# EAGLE design pc3_ext_lis3dh (EAGLE 9.6.2)
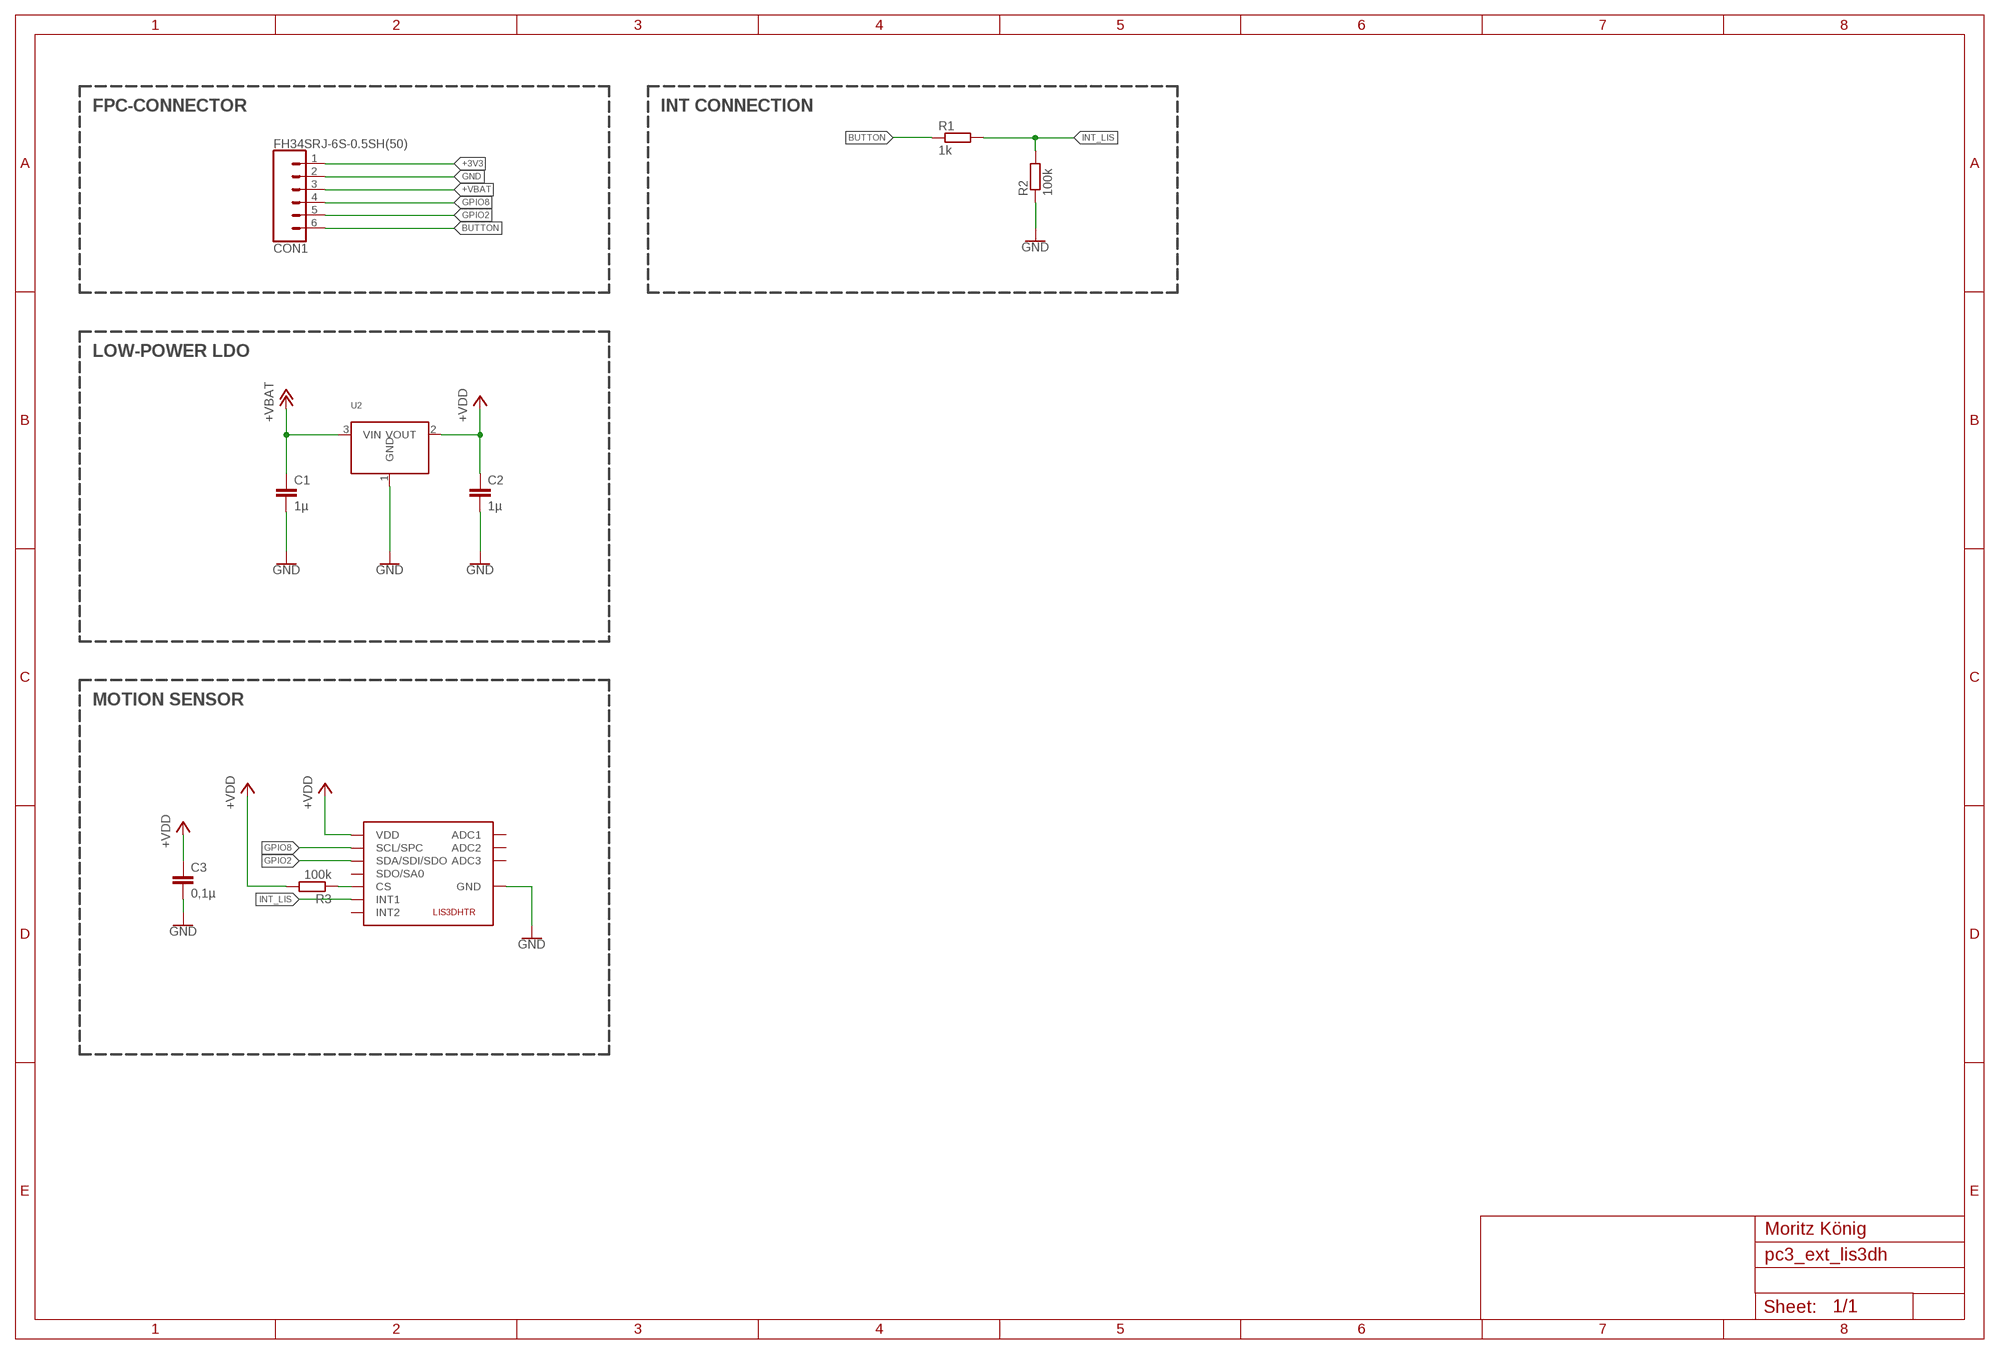
[diagram p0: schematic, sheet 1]

## Parts
C1  1µ  C0402_S  [C0402_S]
C2  1µ  C0402_S  [C0402_S]
C3  0,1µ  C0402_S  [C0402_S]
CON1  FH34SRJ-6S-0.5SH(50)  [FH34SRJ-6S-0.5SH(50)]
R1  1k  R0402  [R0402]
R2  100k  R0402  [R0402]
R3  100k  R0402  [R0402]
U1  LIS3DHTR  [LGA_16_LIS3DHTR]
U2  SE82XX  [SOT23-3]

## Nets
+3V3: CON1.1
+VBAT: C1.P$1 CON1.3 U2.3(VIN)
+VDD: C2.P$1 C3.P$1 R3.2 U1.P$1(VDD) U1.P$14(VDD) U2.2(VOUT)
BUTTON: CON1.6 R1.1
GND: C1.P$2 C2.P$2 C3.P$2 CON1.2 R2.1 U1.P$5(GND) U1.P$10(GND) U1.P$12(GND) U2.1(GND)
GPIO2: CON1.5 U1.P$6(SDA/SDI/SDO)
GPIO8: CON1.4 U1.P$4(SCL/SPC)
INT_LIS: R1.2 R2.2 U1.P$11(INT1)
N$1: R3.1 U1.P$8(CS)
Unconnected: U1.P$7(SDO/SA0) U1.P$9(INT2) U1.P$13(ADC3) U1.P$15(ADC2) U1.P$16(ADC1)

## Notes on the sheet
- FPC-CONNECTOR | INT CONNECTION
- LOW-POWER LDO
- MOTION SENSOR
- Moritz König

## Library data of the parts
C1-C3 = moekoe_rcl:C0402
CON1 = moekoe_hardware:FH34SRJ-6S-0.5SH(50)
R1-R3 = moekoe_rcl:R0402
U1 = moekoe_sensors:LIS3DHTR
U2 = moekoe_ics:SE82XX

## Board
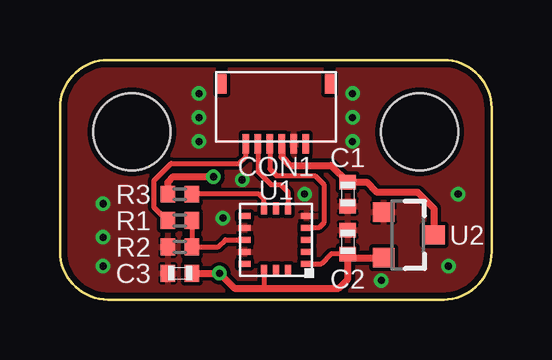
[diagram p1: board, top side]
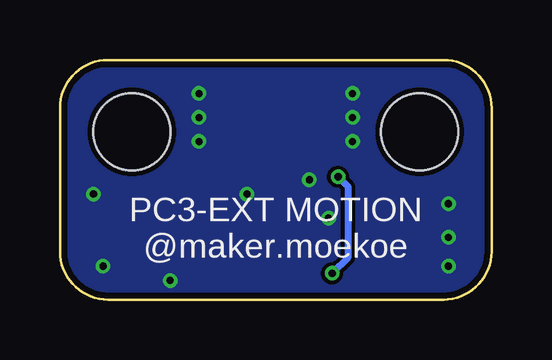
[diagram p2: board, bottom side, seen from below]

Size 18 x 10 mm. Coordinates in mm from the lower left corner, seen from the top.
Outline: 18,2 18,8 arc90 16,10 2,10 arc90 0,8 0,2 arc90 2,0 16,0 arc90 18,2
Copper layers (1*16): Top 0.035mm / dielectric 0.93mm / Bottom 0.035mm
Design rules "2020.08.24_4layers_eagle *": minimum track width 6mil, minimum drill 0.2mm, track to track 6mil, track to pad 6mil, pad to pad 6mil, via to via 6mil, smd to smd 6mil, copper to edge 10mil, drill to drill 6mil, minimum pad ring 10mil, minimum via ring 6mil, stop-mask expansion 0mil, vias tented up to drill 0.5mm, thermal gap 4mil
Holes 3.2 mm at 3,7 15,7

### Footprints (pad centres in the part's own frame; a part is rotated, then mirrored left to right if it is on the bottom)
C0402_S = smd 0.6 x 0.7: P$1 -0.5,0; P$2 0.5,0
FH34SRJ-6S-0.5SH(50) = smd 0.28 x 0.8: 1 -1.25,0; 2 -0.75,0; 3 -0.25,0; 4 0.25,0; 5 0.75,0; 6 1.25,0 | smd 0.4 x 0.8: P$1 -2.25,-2.5; P$2 2.25,-2.5
R0402 = smd 0.6 x 0.7: 1 -0.5,0; 2 0.5,0
LGA_16_LIS3DHTR = smd 0.5 x 0.25: P$1 -1.3,1; P$2 -1.3,0.5; P$3 -1.3,0; P$4 -1.3,-0.5; P$5 -1.3,-1; P$9 1.3,-1; P$10 1.3,-0.5; P$11 1.3,0; P$12 1.3,0.5; P$13 1.3,1 | smd 0.25 x 0.5: P$6 -0.5,-1.3; P$7 0,-1.3; P$8 0.5,-1.3; P$14 0.5,1.3; P$15 0,1.3; P$16 -0.5,1.3
SOT23-3 = smd 0.8 x 0.9: 1 -0.95,-1; 2 0.95,-1; 3 0,1.1

### Placement (x,y rotation side)
C1  12,4.4 270 top
C2  12,2.4 90 top
C3  5,1.1 180 top
CON1  9,6.5 180 top
R1  5,3.3 0 top
R2  5,2.2 0 top
R3  5,4.4 180 top
U1  9,2.5 180 top
U2  14.5,2.7 270 top

### Tracks (layer width: path | path; a pad name or v marks a point on that pad's centre or on a via)
+VBAT
  Top 0.3: CON1.3 9.25,5.95 9.6,5.6 11.3,5.6 C1.P$1 12.8,4.9 13.22,4.47 14.93,4.47 15.6,3.8 U2.3
+VDD  (via drill 0.3 pad 0.6)
  Top 0.2: U1.P$1 10.9,1.5 11.3,1.9 C2.P$1 | U1.P$14 8.5,0.47
  Top 0.3: U2.2 12.15,1.75 C2.P$1 12,0.85 11.62,0.47 8.5,0.47 7.28,0.47 v6.65,1.1 C3.P$1 | R3.2 4.5,4.9 4.73,5.13 v6.4,5.13
  Bottom 0.3: v6.4,5.13 6,4.73 6,1.75 v6.65,1.1
BUTTON
  Top 0.2: R1.1 4.47,3.3 3.92,3.85 3.92,4.96 4.64,5.68 7.46,5.68 7.75,5.97 CON1.6
GND  (via drill 0.3 pad 0.6)
  other vias: 1.8,2.6 5.8,8.6 5.8,7.6 5.8,6.6 12.2,8.6 12.2,7.6 12.2,6.6 10.2,4.4 16.2,1.4 16.6,4.4 6.8,3.4 1.8,4 1.8,1.4 7.6,5 13.4,0.8
  pour Bottom: 15.75,0.25 2.25,0.25 arc-90 0.25,2.25 0.25,7.75 arc-90 2.25,9.75 15.75,9.75 arc-90 17.75,7.75 17.75,2.25 arc-90
  pour Top: 15.75,0.25 2.25,0.25 arc-90 0.25,2.25 0.25,7.75 arc-90 2.25,9.75 15.75,9.75 arc-90 17.75,7.75 17.75,2.25 arc-90
GPIO2
  Top 0.2: CON1.5 8.25,5.35 8.8,4.8 9.2,4.8 9.5,4.5 U1.P$6
GPIO8
  Top 0.2: CON1.4 8.75,5.45 9.03,5.17 10.62,5.17 11,4.8 11,3.2 10.8,3 U1.P$4
INT_LIS
  Top 0.2: U1.P$11 6.9,2.5 6.6,2.2 R2.2 R1.2
N$1
  Top 0.2: U1.P$8 8.5,4.2 8.3,4.4 R3.1

### Text on the board
bNames: PC3-EXT MOTION / @maker.moekoe
tSilkNew: Picoclick C3 / @maker.moekoe / 21.11.2021
bSilkNew: Picoclick C3 | 21.11.2021 / @maker.moekoe